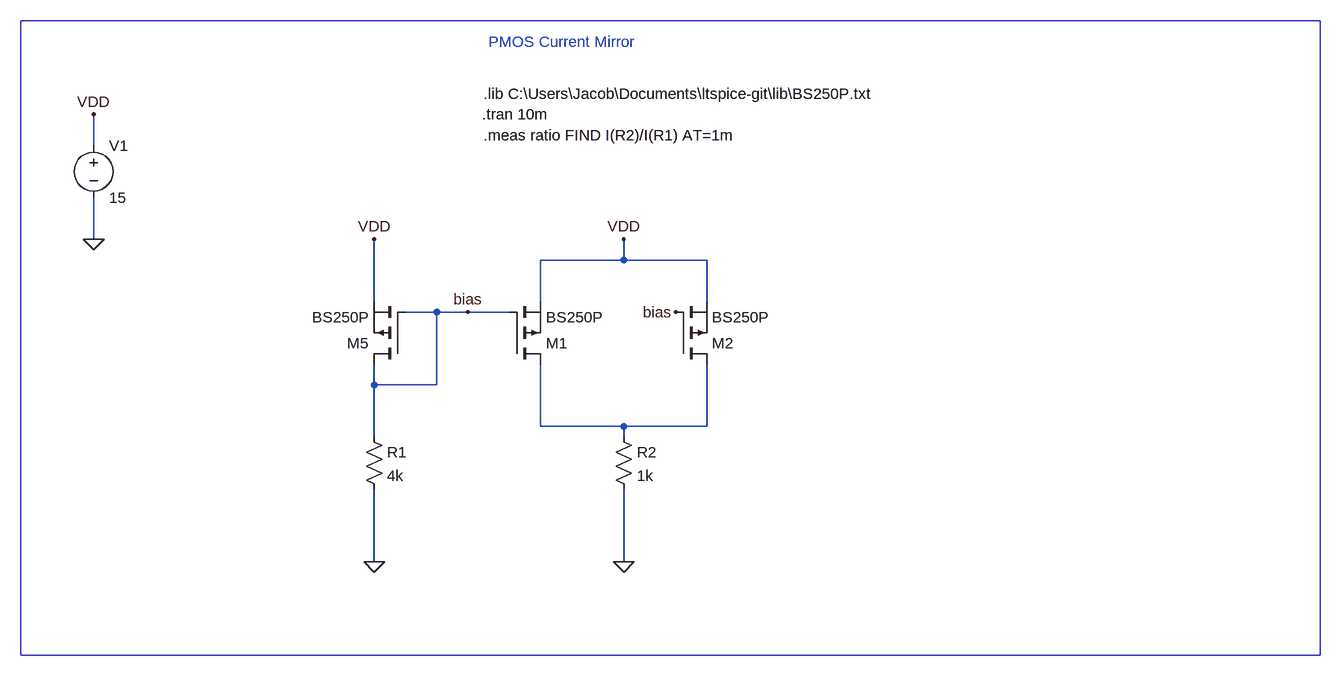
[diagram p0: schematic pmos_current_mirror.asc]
pmos_current_mirror.asc, the LTspice schematic file:
Version 4
SHEET 1 1588 680
WIRE -368 -416 -368 -464
WIRE -368 -272 -368 -336
WIRE 448 -240 448 -272
WIRE 448 -240 320 -240
WIRE 576 -240 448 -240
WIRE 64 -176 64 -272
WIRE 320 -176 320 -240
WIRE 576 -176 576 -240
WIRE 160 -160 112 -160
WIRE 208 -160 160 -160
WIRE 272 -160 208 -160
WIRE 64 -48 64 -80
WIRE 160 -48 160 -160
WIRE 160 -48 64 -48
WIRE 320 16 320 -80
WIRE 448 16 320 16
WIRE 576 16 576 -80
WIRE 576 16 448 16
WIRE 64 32 64 -48
WIRE 448 32 448 16
WIRE 64 224 64 112
WIRE 448 224 448 112
FLAG -368 -464 VDD
FLAG -368 -272 0
FLAG 64 -272 VDD
FLAG 448 -272 VDD
FLAG 64 224 0
FLAG 448 224 0
FLAG 208 -160 bias
FLAG 528 -160 bias
SYMBOL voltage -368 -432 R0
WINDOW 123 0 0 Left 0
WINDOW 39 0 0 Left 0
SYMATTR InstName V1
SYMATTR Value 15
SYMBOL pmos 112 -80 R180
SYMATTR InstName M5
SYMATTR Value BS250P
SYMATTR Prefix X
SYMBOL pmos 272 -80 M180
SYMATTR InstName M1
SYMATTR Value BS250P
SYMATTR Prefix X
SYMBOL res 48 16 R0
SYMATTR InstName R1
SYMATTR Value 4k
SYMBOL res 432 16 R0
SYMATTR InstName R2
SYMATTR Value 1k
SYMBOL pmos 528 -80 M180
SYMATTR InstName M2
SYMATTR Value BS250P
SYMATTR Prefix X
TEXT 232 -496 Left 2 !.lib C:\\Users\\Jacob\\Documents\\ltspice-git\\lib\\BS250P.txt
TEXT 230 -464 Left 2 !.tran 10m
TEXT 240 -576 Left 2 ;PMOS Current Mirror
TEXT 232 -432 Left 2 !.meas ratio FIND I(R2)/I(R1) AT=1m
RECTANGLE Normal 1520 368 -480 -608

The netlist it stands for:
* pmos_current_mirror.asc
V1 VDD 0 15
XM5 bias bias VDD BS250P  ; pins D G S
XM1 N001 bias VDD BS250P  ; pins D G S
R1 bias 0 4k
R2 N001 0 1k
XM2 N001 bias VDD BS250P  ; pins D G S
.lib C:\Users\Jacob\Documents\ltspice-git\lib\BS250P.txt
.tran 10m
* PMOS Current Mirror
.meas ratio FIND I(R2)/I(R1) AT=1m
.backanno
.end